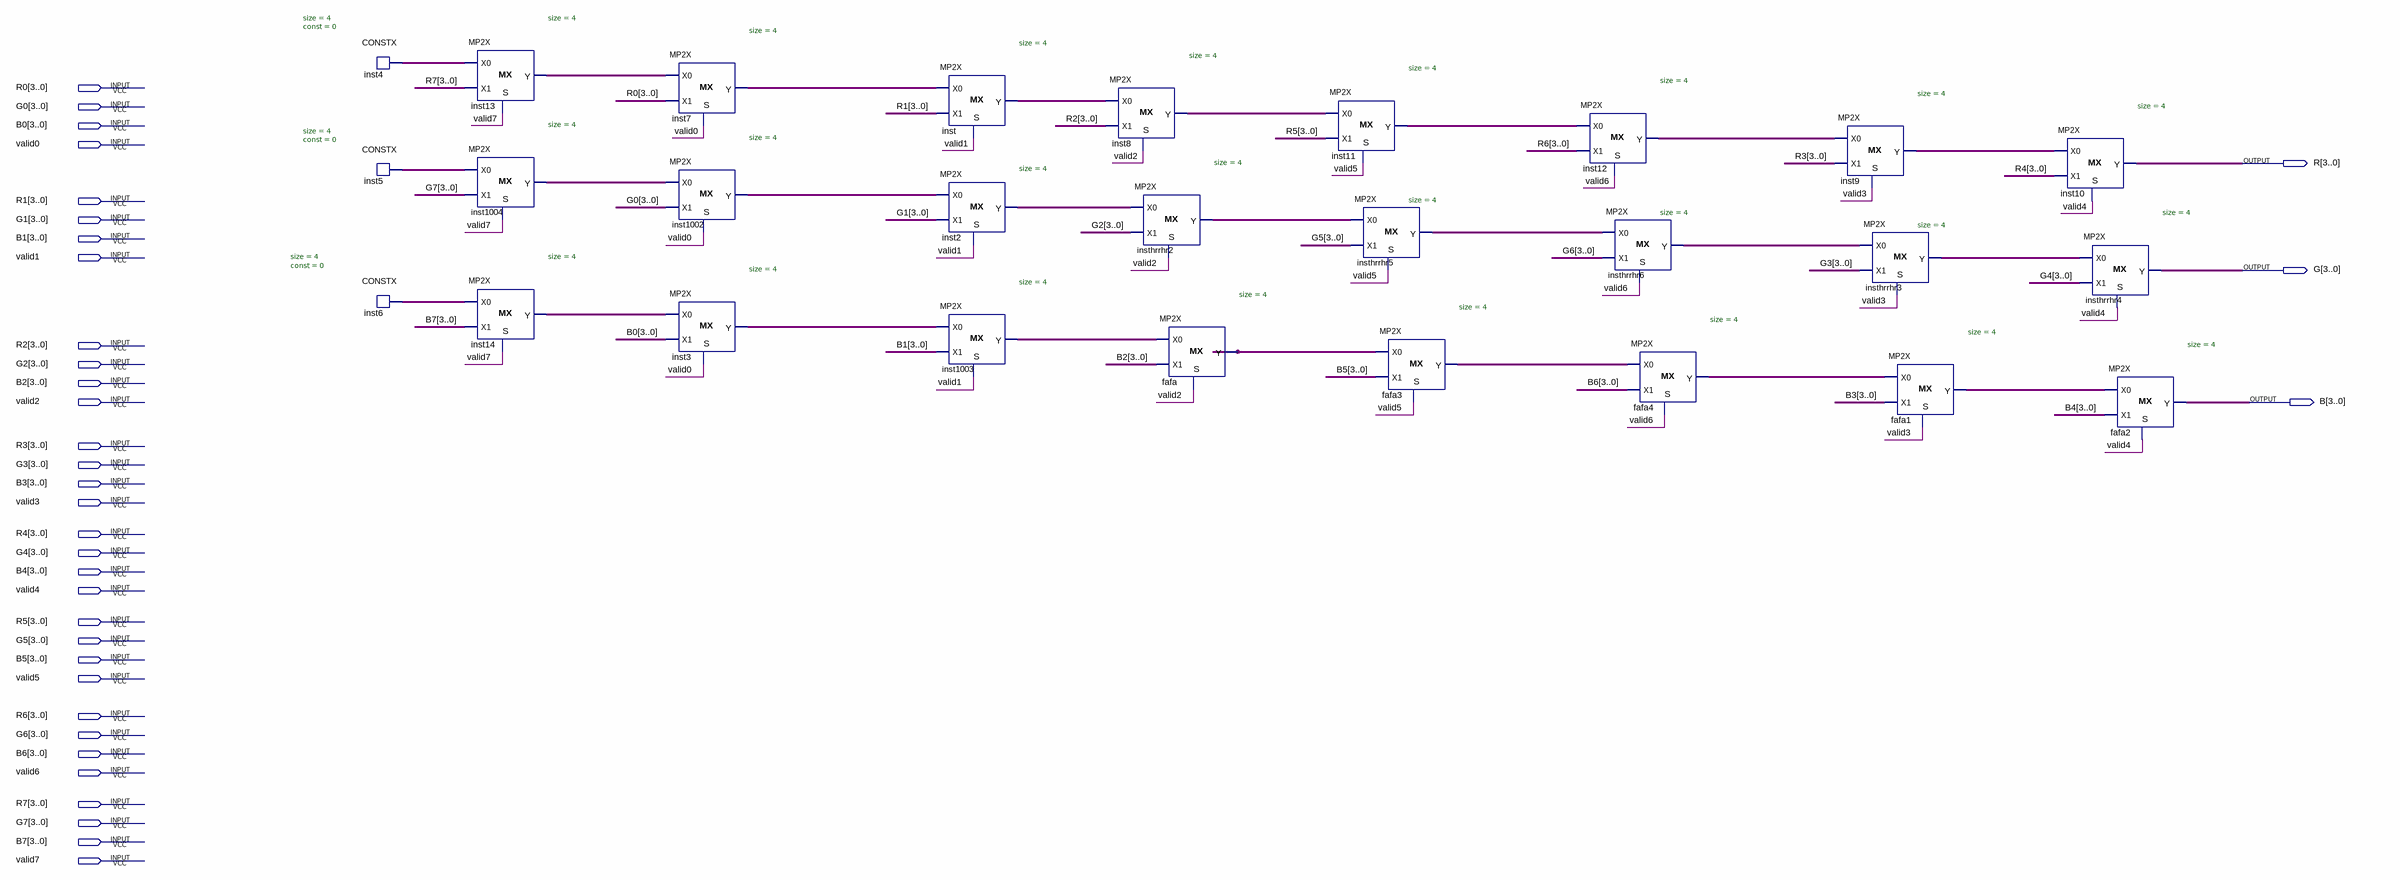
[diagram p0: schematic sheet]
// Quartus schematic colorOut.bdf as structural Verilog: 27 symbols, 35 pins
module colorOut (
  input  [3:0] R0,
  input  [3:0] G0,
  input  [3:0] B0,
  input  valid0,
  input  [3:0] R1,
  input  [3:0] G1,
  input  [3:0] B1,
  input  valid1,
  input  [3:0] R2,
  input  [3:0] G2,
  input  [3:0] B2,
  input  valid2,
  input  [3:0] R3,
  input  [3:0] G3,
  input  [3:0] B3,
  input  valid3,
  input  [3:0] R4,
  input  [3:0] G4,
  input  [3:0] B4,
  input  valid4,
  input  [3:0] R5,
  input  [3:0] G5,
  input  [3:0] B5,
  input  valid5,
  input  [3:0] R6,
  input  [3:0] G6,
  input  [3:0] B6,
  input  valid6,
  input  [3:0] R7,
  input  [3:0] G7,
  input  [3:0] B7,
  input  valid7,
  output [3:0] R,
  output [3:0] G,
  output [3:0] B
);

  wire [3:0] fafa1_y, fafa3_y, fafa4_y, fafa_y, inst2_y, inst3_y, inst4_data, inst5_data, inst6_data,
       inst7_y, inst8_y, inst9_y, inst11_y, inst12_y, inst13_y, inst14_y, inst1002_y, inst1003_y, inst1004_y,
       inst_y, insthrrhr2_y, insthrrhr3_y, insthrrhr5_y, insthrrhr6_y;

  CONSTX #(.size(4), .\const (0)) inst4 (.data(inst4_data));
  CONSTX #(.size(4), .\const (0)) inst5 (.data(inst5_data));
  CONSTX #(.size(4), .\const (0)) inst6 (.data(inst6_data));
  MP2X #(.size(4)) inst13 (.S(valid7), .X0(inst4_data), .X1(R7), .Y(inst13_y));
  MP2X #(.size(4)) inst1004 (.S(valid7), .X0(inst5_data), .X1(G7), .Y(inst1004_y));
  MP2X #(.size(4)) inst14 (.S(valid7), .X0(inst6_data), .X1(B7), .Y(inst14_y));
  MP2X #(.size(4)) inst7 (.S(valid0), .X0(inst13_y), .X1(R0), .Y(inst7_y));
  MP2X #(.size(4)) inst1002 (.S(valid0), .X0(inst1004_y), .X1(G0), .Y(inst1002_y));
  MP2X #(.size(4)) inst3 (.S(valid0), .X0(inst14_y), .X1(B0), .Y(inst3_y));
  MP2X #(.size(4)) inst (.S(valid1), .X0(inst7_y), .X1(R1), .Y(inst_y));
  MP2X #(.size(4)) inst2 (.S(valid1), .X0(inst1002_y), .X1(G1), .Y(inst2_y));
  MP2X #(.size(4)) inst1003 (.S(valid1), .X0(inst3_y), .X1(B1), .Y(inst1003_y));
  MP2X #(.size(4)) inst8 (.S(valid2), .X0(inst_y), .X1(R2), .Y(inst8_y));
  MP2X #(.size(4)) insthrrhr2 (.S(valid2), .X0(inst2_y), .X1(G2), .Y(insthrrhr2_y));
  MP2X #(.size(4)) fafa (.S(valid2), .X0(inst1003_y), .X1(B2), .Y(fafa_y));
  MP2X #(.size(4)) inst11 (.S(valid5), .X0(inst8_y), .X1(R5), .Y(inst11_y));
  MP2X #(.size(4)) insthrrhr5 (.S(valid5), .X0(insthrrhr2_y), .X1(G5), .Y(insthrrhr5_y));
  MP2X #(.size(4)) fafa3 (.S(valid5), .X0(fafa_y), .X1(B5), .Y(fafa3_y));
  MP2X #(.size(4)) inst12 (.S(valid6), .X0(inst11_y), .X1(R6), .Y(inst12_y));
  MP2X #(.size(4)) insthrrhr6 (.S(valid6), .X0(insthrrhr5_y), .X1(G6), .Y(insthrrhr6_y));
  MP2X #(.size(4)) fafa4 (.S(valid6), .X0(fafa3_y), .X1(B6), .Y(fafa4_y));
  MP2X #(.size(4)) inst9 (.S(valid3), .X0(inst12_y), .X1(R3), .Y(inst9_y));
  MP2X #(.size(4)) insthrrhr3 (.S(valid3), .X0(insthrrhr6_y), .X1(G3), .Y(insthrrhr3_y));
  MP2X #(.size(4)) fafa1 (.S(valid3), .X0(fafa4_y), .X1(B3), .Y(fafa1_y));
  MP2X #(.size(4)) inst10 (.S(valid4), .X0(inst9_y), .X1(R4), .Y(R));
  MP2X #(.size(4)) insthrrhr4 (.S(valid4), .X0(insthrrhr3_y), .X1(G4), .Y(G));
  MP2X #(.size(4)) fafa2 (.S(valid4), .X0(fafa1_y), .X1(B4), .Y(B));
endmodule
